# EAGLE schematic SchematProcesor (EAGLE 9.7.0)

## Sheet 1 of 3
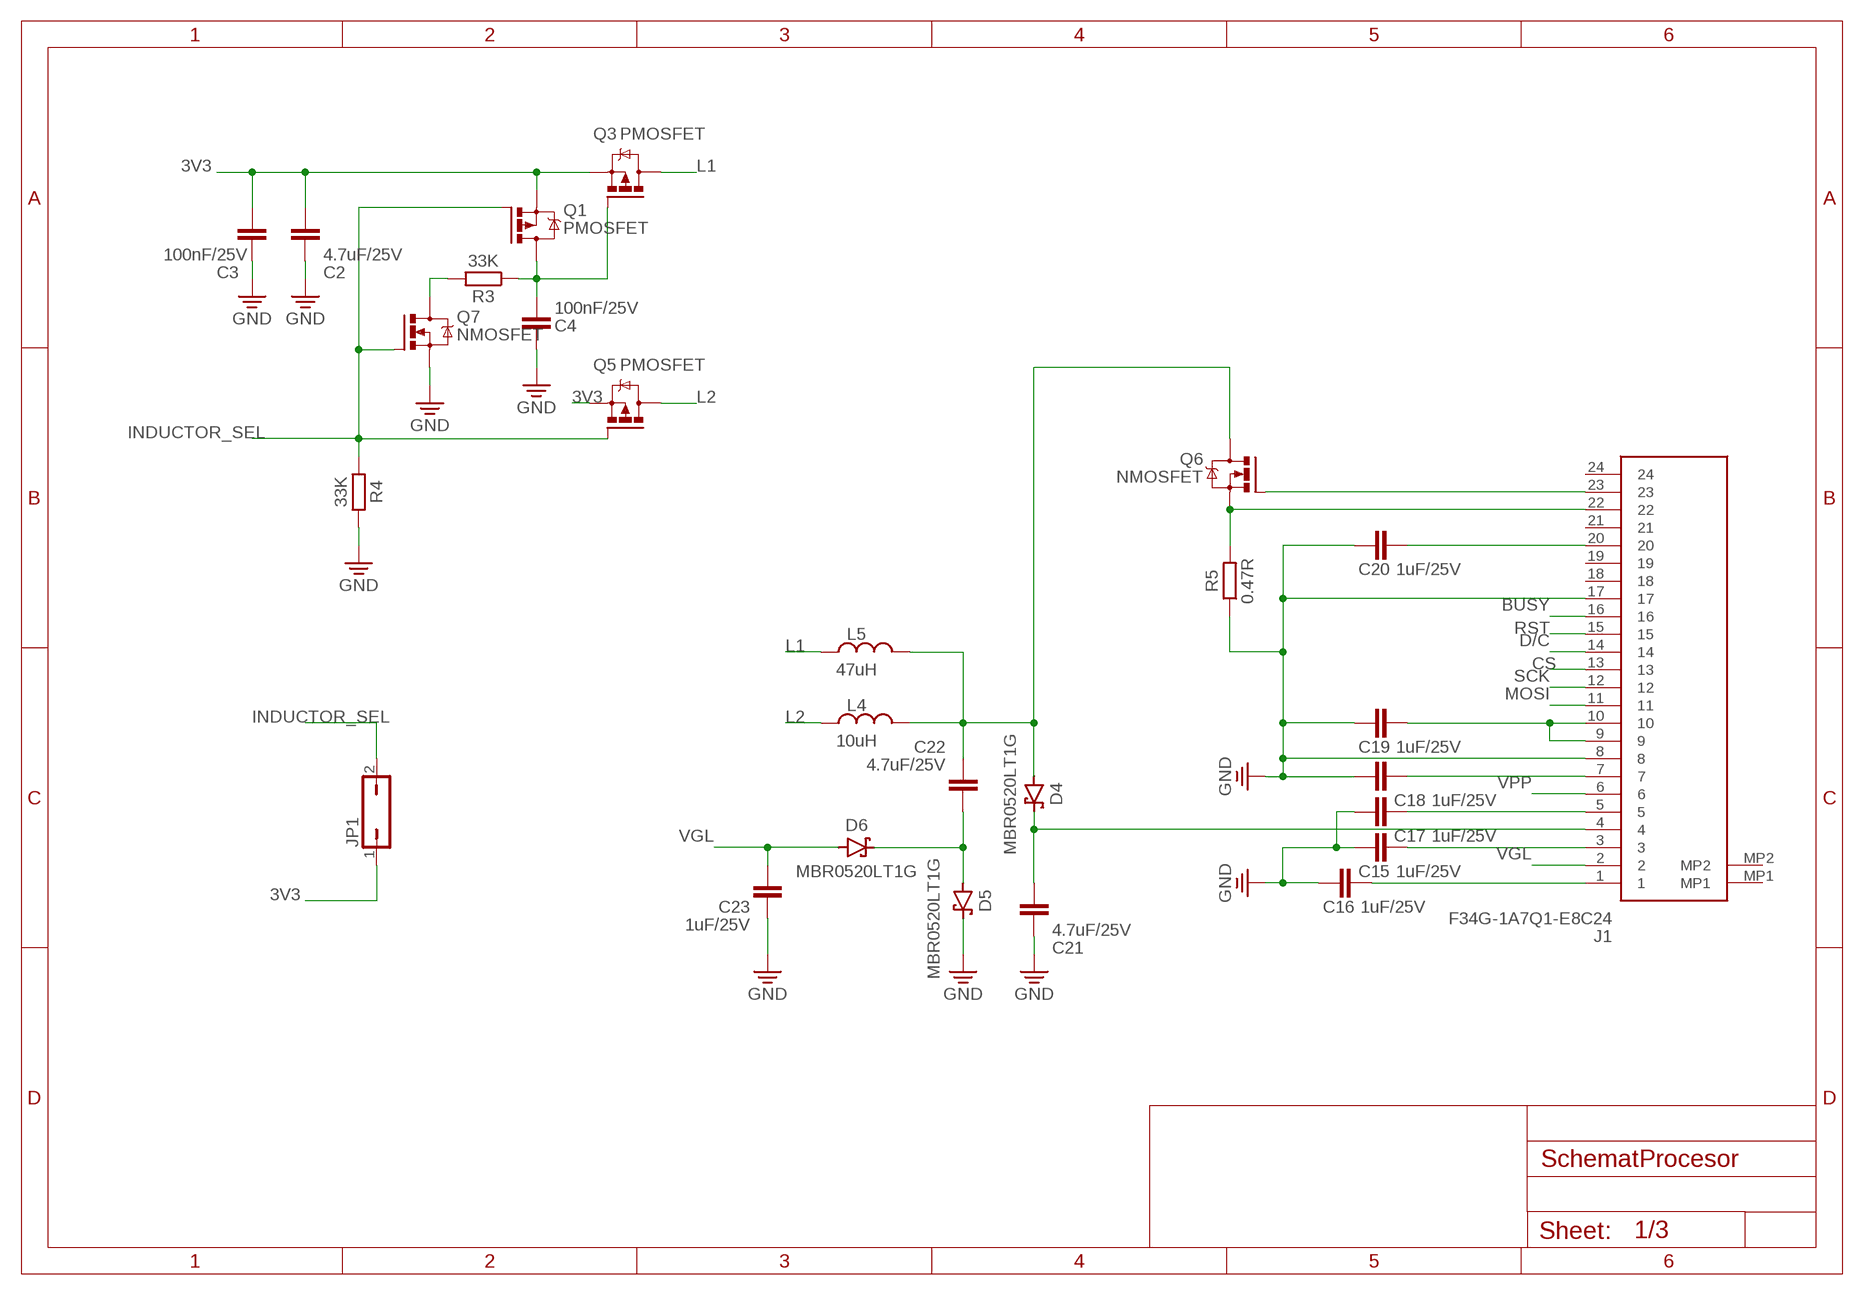
[diagram p0: schematic, sheet 1]

### Parts
C2  4.7uF/25V  C_CHIP-0603(1608-METRIC)  [CAPC1608X85]
C3  100nF/25V  C_CHIP-0603(1608-METRIC)  [CAPC1608X85]
C4  100nF/25V  C_CHIP-0603(1608-METRIC)  [CAPC1608X85]
C15  1uF/25V  C_CHIP-0603(1608-METRIC)  [CAPC1608X85]
C16  1uF/25V  C_CHIP-0603(1608-METRIC)  [CAPC1608X85]
C17  1uF/25V  C_CHIP-0603(1608-METRIC)  [CAPC1608X85]
C18  1uF/25V  C_CHIP-0603(1608-METRIC)  [CAPC1608X85]
C19  1uF/25V  C_CHIP-0603(1608-METRIC)  [CAPC1608X85]
C20  1uF/25V  C_CHIP-0603(1608-METRIC)  [CAPC1608X85]
C21  4.7uF/25V  C_CHIP-0603(1608-METRIC)  [CAPC1608X85]
C22  4.7uF/25V  C_CHIP-0603(1608-METRIC)  [CAPC1608X85]
C23  1uF/25V  C_CHIP-0603(1608-METRIC)  [CAPC1608X85]
D4  MBR0520LT1G  SCHOTTKY_MBR0520LT1GDO-219  [SODFL3718X115]
D5  MBR0520LT1G  SCHOTTKY_MBR0520LT1GDO-219  [SODFL3718X115]
D6  MBR0520LT1G  SCHOTTKY_MBR0520LT1GDO-219  [SODFL3718X115]
J1  F34G-1A7Q1-E8C24  [F34G1A7Q1E8C24]
JP1  JP1Q  [JP1]
L4  10uH  L_CHIP-0603(1608-METRIC)  [INDC1608X95N]
L5  47uH  L_CHIP-0603(1608-METRIC)  [INDC1608X95N]
Q1  PMOSFET  PMOSFET_SOT23-GSD  [SOT23]
Q3  PMOSFET  PMOSFET_SOT23-GSD  [SOT23]
Q5  PMOSFET  PMOSFET_SOT23-GSD  [SOT23]
Q6  NMOSFET  NMOSFETSOT23-GSD  [SOT23]
Q7  NMOSFET  NMOSFETSOT23-GSD  [SOT23]
R3  33K  R_CHIP-0603(1608-METRIC)  [RESC1608X60]
R4  33K  R_CHIP-0603(1608-METRIC)  [RESC1608X60]
R5  0.47R  R_CHIP-0603(1608-METRIC)  [RESC1608X60]

### Nets
3V3: C2.2 C3.2 JP1.1 Q1.2(S) Q3.2(S) Q5.2(S) ; also sheet 2,3
BUSY: J1.16 ; also sheet 3
CS: J1.13 ; also sheet 3
D/C: J1.14 ; also sheet 3
GND: C2.1 C3.1 C4.1 C15.1 C16.1 C17.1 C18.1 C19.1 C20.1 C21.1 C23.2 D5.1(C) J1.8 J1.17 Q7.2(S) R4.2 R5.1 ; also sheet 2,3
INDUCTOR_SEL: JP1.2 Q1.1(G) Q5.1(G) Q7.1(G) R4.1
L1: L5.1 Q3.3(D)
L2: L4.1 Q5.3(D)
MOSI: J1.11 ; also sheet 3
N$4: C4.2 Q1.3(D) Q3.1(G) R3.1
N$5: C16.2 J1.1
N$6: C15.2 J1.3
N$7: C17.2 J1.5
N$8: C18.2 J1.7
N$10: C19.2 J1.9 J1.10
N$11: Q7.3(D) R3.2
N$12: C20.2 J1.20
N$13: J1.23 Q6.1(G)
N$14: J1.22 Q6.2(S) R5.2
N$15: C21.2 D4.1(C) J1.4
N$16: C22.1 D4.2(A) L4.2 L5.2 Q6.3(D)
N$17: C22.2 D5.2(A) D6.1(C)
RST: J1.15 ; also sheet 3
SCK: J1.12 ; also sheet 3
VGL: C23.1 D6.2(A) J1.2
VPP: J1.6
Unconnected: J1.18 J1.19 J1.21 J1.24 J1.MP1 J1.MP2

## Sheet 2 of 3
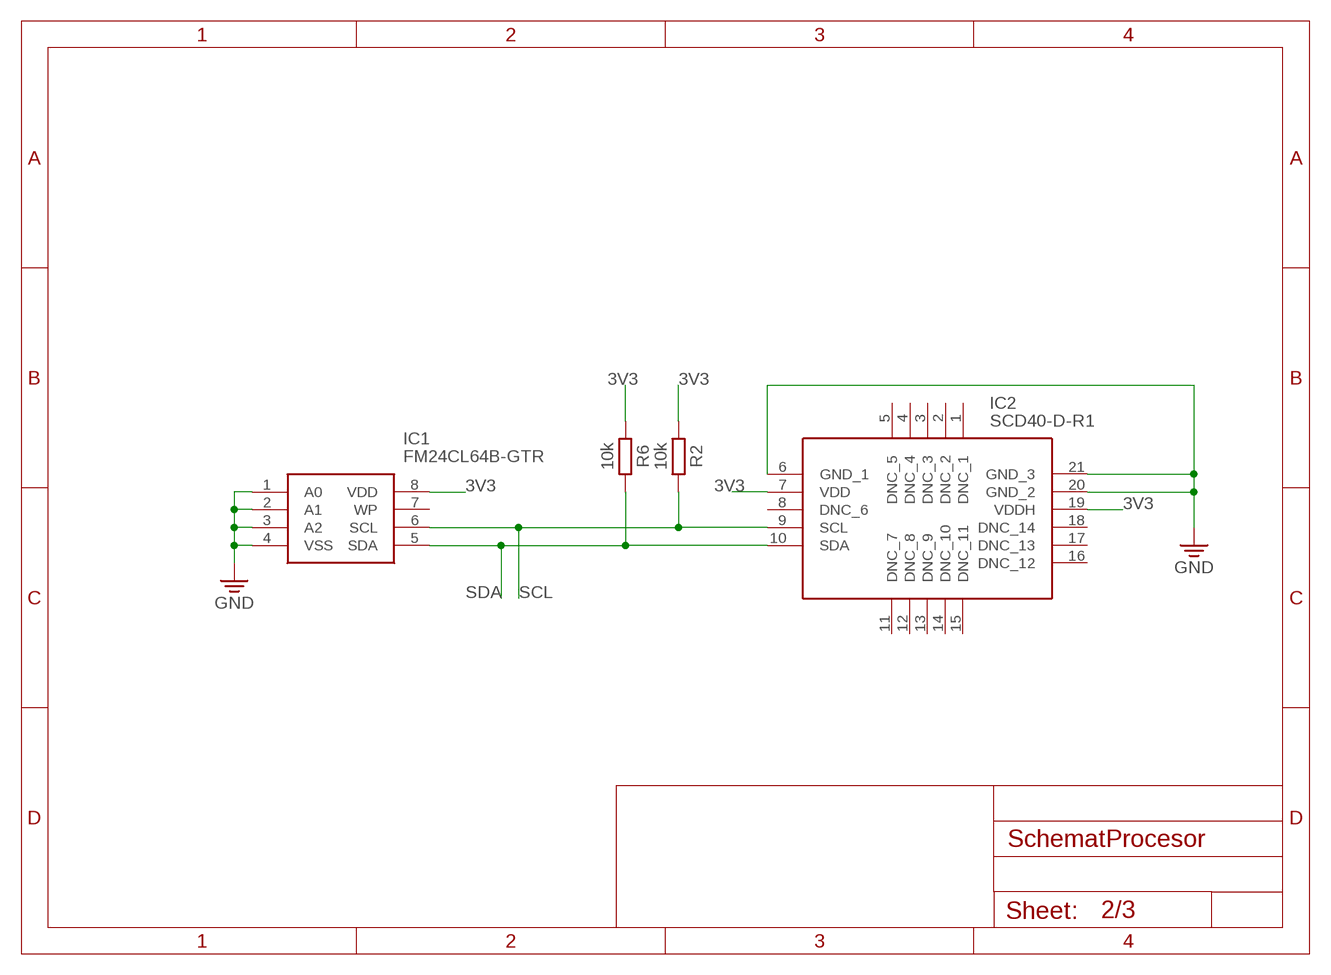
[diagram p1: schematic, sheet 2]

### Parts
IC1  FM24CL64B-GTR  [SOIC127P602X173-8N]
IC2  SCD40-D-R1  [SCD40DR1]
R2  10k  R_CHIP-0603(1608-METRIC)  [RESC1608X60]
R6  10k  R_CHIP-0603(1608-METRIC)  [RESC1608X60]

### Nets
3V3: IC1.8(VDD) IC2.7(VDD) IC2.19(VDDH) R2.1 R6.1 ; also sheet 1,3
GND: IC1.1(A0) IC1.2(A1) IC1.3(A2) IC1.4(VSS) IC2.6(GND_1) IC2.20(GND_2) IC2.21(GND_3) ; also sheet 1,3
SCL: IC1.6(SCL) IC2.9(SCL) R2.2 ; also sheet 3
SDA: IC1.5(SDA) IC2.10(SDA) R6.2 ; also sheet 3
Unconnected: IC1.7(WP) IC2.1(DNC_1) IC2.2(DNC_2) IC2.3(DNC_3) IC2.4(DNC_4) IC2.5(DNC_5) IC2.8(DNC_6) IC2.11(DNC_7) IC2.12(DNC_8) IC2.13(DNC_9) IC2.14(DNC_10) IC2.15(DNC_11) IC2.16(DNC_12) IC2.17(DNC_13) IC2.18(DNC_14)

## Sheet 3 of 3
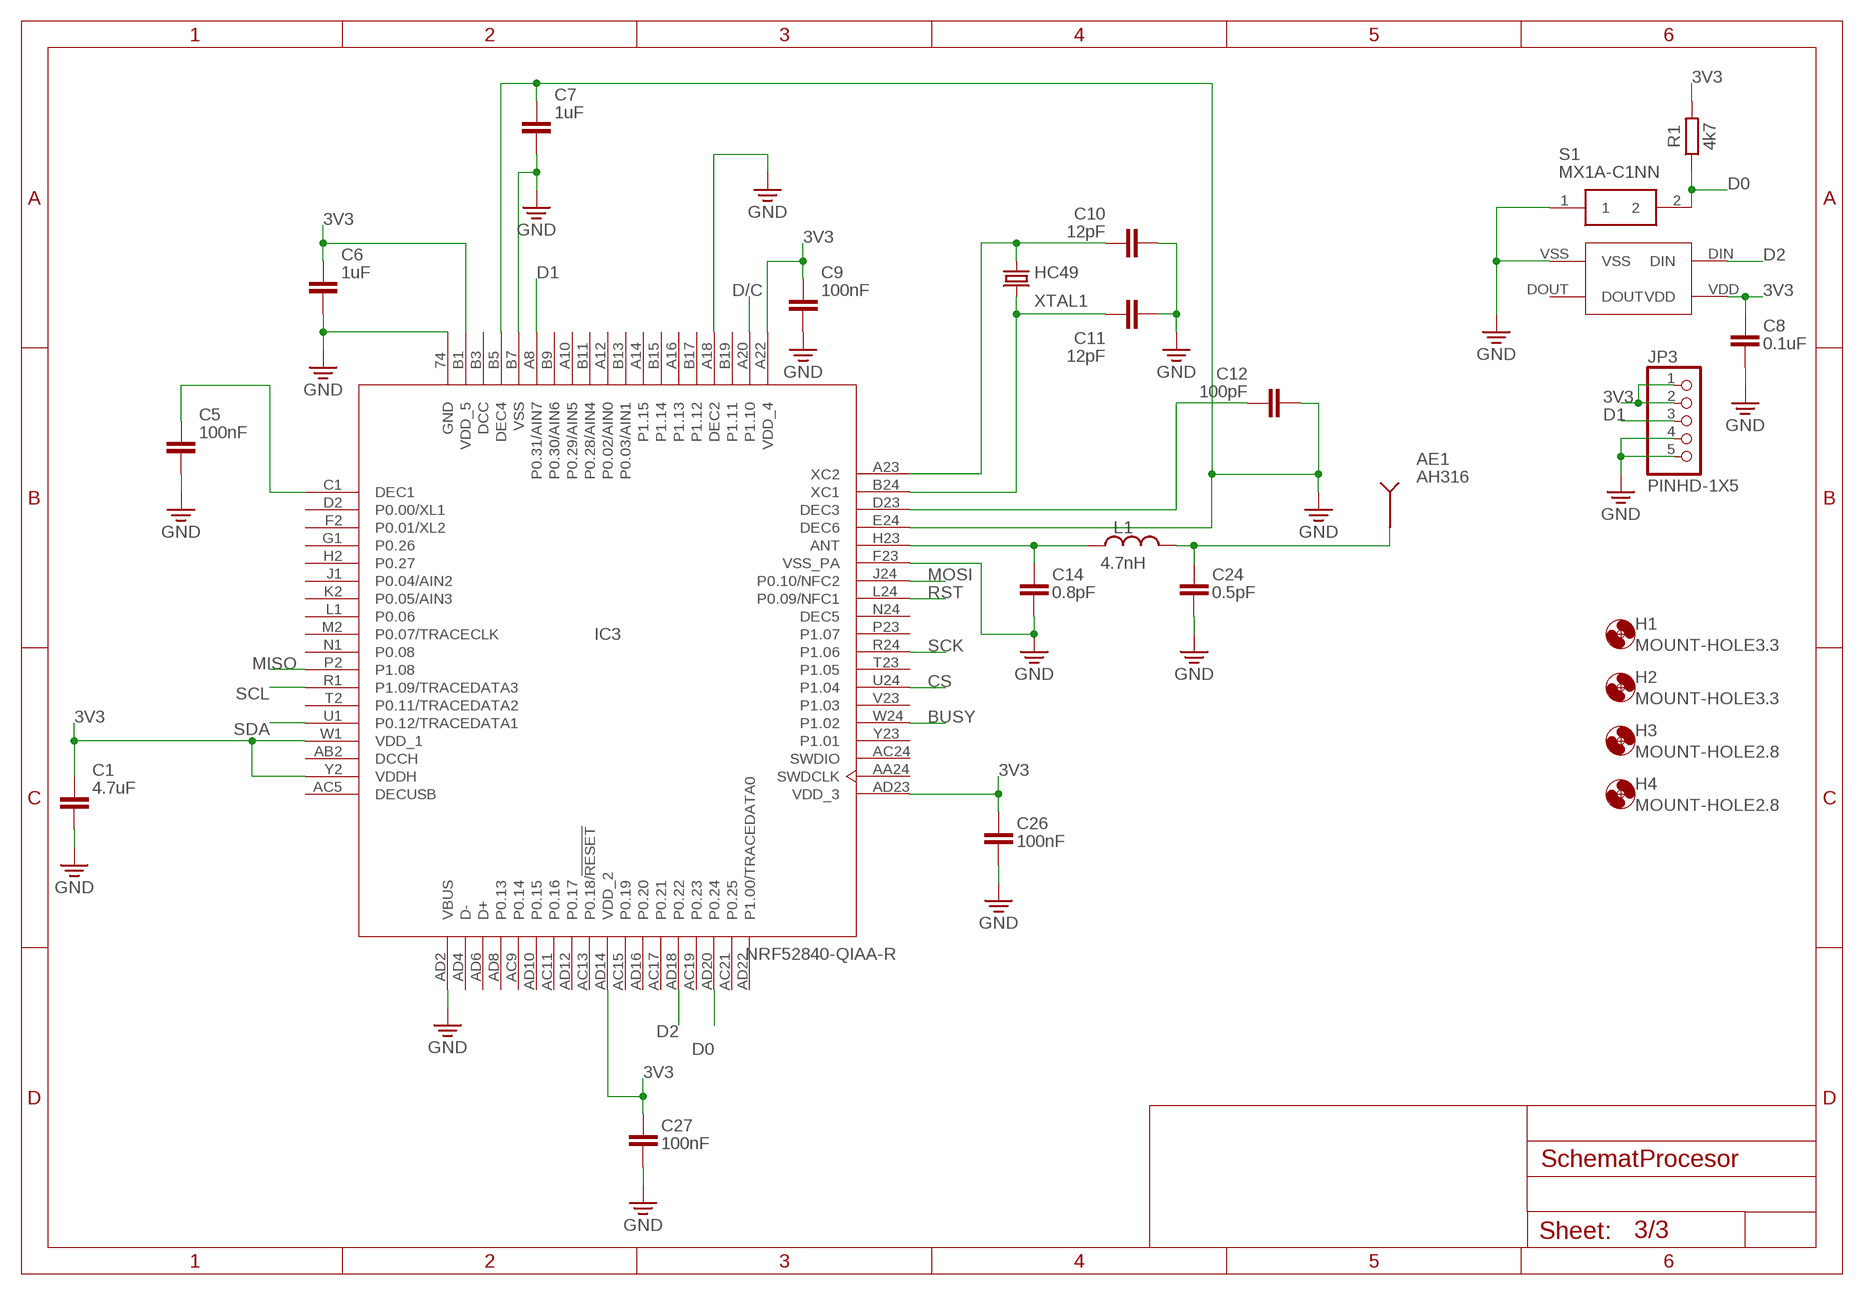
[diagram p2: schematic, sheet 3]

### Parts
AE1  AH316  [ANT-GPS-3.2X1MM]
C1  4.7uF  C_CHIP-0603(1608-METRIC)  [CAPC1608X85]
C5  100nF  C_CHIP-0603(1608-METRIC)  [CAPC1608X85]
C6  1uF  C_CHIP-0603(1608-METRIC)  [CAPC1608X85]
C7  1uF  C_CHIP-0603(1608-METRIC)  [CAPC1608X85]
C8  0.1uF  C_CHIP-0603(1608-METRIC)  [CAPC1608X85]
C9  100nF  C_CHIP-0603(1608-METRIC)  [CAPC1608X85]
C10  12pF  C_CHIP-0603(1608-METRIC)  [CAPC1608X85]
C11  12pF  C_CHIP-0603(1608-METRIC)  [CAPC1608X85]
C12  100pF  C_CHIP-0603(1608-METRIC)  [CAPC1608X85]
C14  0.8pF  C_CHIP-0603(1608-METRIC)  [CAPC1608X85]
C24  0.5pF  C_CHIP-0603(1608-METRIC)  [CAPC1608X85]
C26  100nF  C_CHIP-0603(1608-METRIC)  [CAPC1608X85]
C27  100nF  C_CHIP-0603(1608-METRIC)  [CAPC1608X85]
H1  MOUNT-HOLE3.3  [3,3]
H2  MOUNT-HOLE3.3  [3,3]
H3  MOUNT-HOLE2.8  [2,8]
H4  MOUNT-HOLE2.8  [2,8]
IC3  NRF52840-QIAA-R  [NRF52840-QIAA]
JP3  PINHD-1X5  [1X05]
L1  4.7nH  L_CHIP-0603(1608-METRIC)  [INDC1608X95N]
R1  4k7  R_CHIP-0402(1005-METRIC)  [RESC1005X40]
S1  MX1A-C1NN  [MX1AC1NN]
U$1  N0M59S10IC  [N0M59S10IC]
XTAL1  HC49  CRYSTAL_HC49-11.5L  [XTALRR488W45L1150T500H350B]

### Nets
3V3: C1.1 C6.1 C8.1 C9.1 C26.1 C27.1 IC3.A22(VDD_4) IC3.AD14(VDD_2) IC3.AD23(VDD_3) IC3.B1(VDD_5) IC3.W1(VDD_1) IC3.Y2(VDDH) JP3.1 JP3.2 R1.2 U$1.VDD ; also sheet 1,2
BUSY: IC3.W24(P1.02) ; also sheet 1
CS: IC3.U24(P1.04) ; also sheet 1
D0: IC3.AD20(P0.24) R1.1 S1.2
D1: IC3.A8(P0.31/AIN7) JP3.3
D2: IC3.AD18(P0.22) U$1.DIN
D/C: IC3.A20(P1.10) ; also sheet 1
GND: C1.2 C5.2 C6.2 C7.1 C7.2 C8.2 C9.2 C10.2 C11.2 C12.2 C14.2 C24.2 C26.2 C27.2 IC3.74(GND) IC3.A18(DEC2) IC3.AD2(VBUS) IC3.B5(DEC4) IC3.B7(VSS) IC3.E24(DEC6) IC3.F23(VSS_PA) JP3.4 JP3.5 S1.1 U$1.VSS ; also sheet 1,2
MISO: IC3.P2(P1.08)
MOSI: IC3.J24(P0.10/NFC2) ; also sheet 1
N$3: C11.1 IC3.B24(XC1) XTAL1.2
N$9: C10.1 IC3.A23(XC2) XTAL1.1
N$18: C14.1 IC3.H23(ANT) L1.1
N$19: C12.1 IC3.D23(DEC3)
N$20: AE1.2(GND) C24.1 L1.2
N$22: C5.1 IC3.C1(DEC1)
RST: IC3.L24(P0.09/NFC1) ; also sheet 1
SCK: IC3.R24(P1.06) ; also sheet 1
SCL: IC3.R1(P1.09/TRACEDATA3) ; also sheet 2
SDA: IC3.U1(P0.12/TRACEDATA1) ; also sheet 2
Unconnected: AE1.1(SIG) IC3.A10(P0.29/AIN5) IC3.A12(P0.02/AIN0) IC3.A14(P1.15) IC3.A16(P1.13) IC3.AA24(SWDCLK) IC3.AC9(P0.14) IC3.AC11(P0.16) IC3.AC13(P0.18/!RESET) IC3.AC15(P0.19) IC3.AC17(P0.21) IC3.AC19(P0.23) IC3.AC21(P0.25) IC3.AC24(SWDIO) IC3.AD4(D-) IC3.AD6(D+) IC3.AD8(P0.13) IC3.AD10(P0.15) IC3.AD12(P0.17) IC3.AD16(P0.20) IC3.AD22(P1.00/TRACEDATA0) IC3.B9(P0.30/AIN6) IC3.B11(P0.28/AIN4) IC3.B13(P0.03/AIN1) IC3.B15(P1.14) IC3.B17(P1.12) IC3.B19(P1.11) IC3.D2(P0.00/XL1) IC3.F2(P0.01/XL2) IC3.G1(P0.26) IC3.H2(P0.27) IC3.J1(P0.04/AIN2) IC3.K2(P0.05/AIN3) IC3.L1(P0.06) IC3.M2(P0.07/TRACECLK) IC3.N1(P0.08) IC3.P23(P1.07) IC3.T2(P0.11/TRACEDATA2) IC3.T23(P1.05) IC3.V23(P1.03) IC3.Y23(P1.01) U$1.DOUT

## Power pins joined to a net without a drawn wire
DCC: IC3.B3(DCC)
DCCH: IC3.AB2(DCCH)
DEC5: IC3.N24(DEC5)
DECUSB: IC3.AC5(DECUSB)

## Library data of the parts
AE1 = RF_Wireless:AH: 2.4GHz Chip RF Antenna 2.4GHz - 2.5GHz Datasheet <https://www.yuden.co.jp/productdata/catalog/chipantenna01_e.pdf>; CATEGORY: Antenna; DESCRIPTION: Antenna SURF MOUNT ANTENNA RADIEDGE; MANUFACTURER: Taiyo Yuden; MPN: AH316M245001-T; OPERATING_TEMPERATURE: - 40 C to +85 C; ROHS_COMPLIANT: COMPLIANT; SERIES: AH; SUB_CATEGORY: Antenna; TYPE: 2.4GHz Antenna - 2.4GHz, 5GHz, Bluetooth, WiFi, WLAN, Zigbee
C1-C12 C14-C24 C26 C27 = Capacitor:C: Capacitor - Generic; CATEGORY: Capacitor
D4-D6 = Diode:SCHOTTKY_: Schottky Diode - Popular parts; CATEGORY: Diode; DESCRIPTION: DIODE SCHOTTKY 20V 500MA SOD123; MANUFACTURER: ON Semiconductor; MPN: MBR0520LT1G; SUB-CATEGORY: Schottky
H1-H4 = holes:MOUNT-HOLE: MOUNTING HOLE with drill center marker
IC1 = SamacSys_Parts:FM24CL64B-GTR: CYPRESS - INFINEON TECHNOLOGIES - FM24CL64B-GTR - Ferroelectric RAM (FRAM), 64 Kbit (8K x 8) I2C, 1 MHz, 2.7 V to 3.65 V Supply, SOIC-8 Source: Datasheet <https://componentsearchengine.com/Datasheets/2/FM24CL64B-GTR.pdf>; DESCRIPTION: CYPRESS - INFINEON TECHNOLOGIES - FM24CL64B-GTR - Ferroelectric RAM (FRAM), 64 Kbit (8K x 8) I2C, 1 MHz, 2.7 V to 3.65 V Supply, SOIC-8; HEIGHT: 1.727mm; MANUFACTURER_NAME: Infineon; MANUFACTURER_PART_NUMBER: FM24CL64B-GTR; MOUSER_PART_NUMBER: 877-FM24CL64B-GTR; MOUSER_PRICE-STOCK: https://www.mouser.co.uk/ProductDetail/Infineon-Technologies/FM24CL64B-GTR?qs=pA5MXup5wxFBNKAQkjzmOA%3D%3D
IC2 = SamacSys_Parts:SCD40-D-R1: Breaking the size barrier in CO2 sensing Source: Datasheet <https://www.sensirion.com/fileadmin/user_upload/customers/sensirion/Dokumente/9.5_CO2/Sensirion_CO2_Sensors_SCD4x_Datasheet.pdf>; DESCRIPTION: Breaking the size barrier in CO2 sensing; HEIGHT: 6.8mm; MANUFACTURER_NAME: Sensirion; MANUFACTURER_PART_NUMBER: SCD40-D-R1; MOUSER_PART_NUMBER: 403-SCD40-D-R1; MOUSER_PRICE-STOCK: https://www.mouser.co.uk/ProductDetail/Sensirion/SCD40-D-R1?qs=HBWAp0VN4RjvSDpwiC%2F4pQ%3D%3D
IC3 = IC_Wireless-RF:NRF52840-QI: Bluetooth®5, IEEE 802.15.4-2006, 2.4 GHz transceiver - SoC Datasheet <https://infocenter.nordicsemi.com/pdf/nRF52840_PS_v1.1.pdf> Note : This Part needs to add a thermal vias on VSS_PAD while designing a board.; CATEGORY: IC_Wireless-RF; DESCRIPTION: Bluetooth ® 5, IEEE 802.15.4-2006, 2.4 GHz transceiver; FREQUENCY: 64MHz; IO: 48; MANUFACTURER: Nordic Semiconductor; MPN: nRF52840-QIAA-R; PART_STATUS: Active; ROHS_COMPLIANT: COMPLIANT; SERIES: nRF52840; SUB-CATEGORY: Bluetooth
J1 = Biblioteka:F34G-1A7Q1-E8C24: 24 Position FPC Connector Contacts, Bottom 0.020" (0.50mm) Surface Mount, Right Angle Source: Datasheet <https://cdn.amphenol-cs.com/media/wysiwyg/files/drawing/f34g.pdf>; DESCRIPTION: 24 Position FPC Connector Contacts, Bottom 0.020" (0.50mm) Surface Mount, Right Angle; HEIGHT: 1.75mm; MANUFACTURER_NAME: Amphenol; MANUFACTURER_PART_NUMBER: F34G-1A7Q1-E8C24; MOUSER_PART_NUMBER: 649-F34G1A7Q1E8C24; MOUSER_PRICE-STOCK: https://www.mouser.co.uk/ProductDetail/Amphenol-Aorora/F34G-1A7Q1-E8C24?qs=11PymoJGorK92cO6qHcfCw%3D%3D
JP1 = jumper:JP1Q: JUMPER
JP3 = Connector:PINHD-1X5: PIN HEADER; CATEGORY: Headers; DESCRIPTION: Header, Straight, 5 Position; MANUFACTURER: Generic; MPN: Generic; OPERATING_TEMPERATURE: Generic; PART_STATUS: Active; PITCH: 0.100" (2.54mm); ROHS_COMPLIANCE: Generic; SERIES: Generic; SUB-CATEGORY: Headers, Male Pins; TYPE: Board to Board or Cable, Unshrouded, Through Hole, Straight
L1 L4 L5 = Inductor:L: Inductor Fixed - Generic; CATEGORY: Inductor; SUB-CATEGORY: Fixed
Q1 Q3 Q5 = Transistor:PMOSFET: P-Channel MOSFET - Generic; CATEGORY: Transistor; SUB-CATEGORY: MOSFET; TYPE: P-Channel
Q6 Q7 = Transistor:NMOSFET: N-Channel MOSFET - Generic; CATEGORY: Transistor; SUB-CATEGORY: MOSFET; TYPE: N-Channel
R1-R6 = Resistor:R: Resistor Fixed - Generic; CATEGORY: Resistor; SUB-CATEGORY: Fixed
S1 = SamacSys_Parts:MX1A-C1NN: Pushbutton Switches Full Travel, Mech. Keyswitch Tactile Feel (Clear stem), 65cN No LED, No Diode Frame Mount (no fixation pins) Source: Datasheet <https://media.digikey.com/pdf/Data Sheets/Cherry PDFs/MX Series.pdf>; DESCRIPTION: Pushbutton Switches Full Travel, Mech. Keyswitch Tactile Feel (Clear stem), 65cN No LED, No Diode Frame Mount (no fixation pins); HEIGHT: 15.2mm; MANUFACTURER_NAME: Cherry; MANUFACTURER_PART_NUMBER: MX1A-C1NN; MOUSER_PART_NUMBER: 540-MX1A-C1NN; MOUSER_PRICE-STOCK: https://www.mouser.co.uk/ProductDetail/CHERRY/MX1A-C1NN?qs=Z9t1pRjfOcwvorA009Lo0w%3D%3D
U$1 = N0M59S10IC:N0M59S10IC
XTAL1 = Frequency-Source:CRYSTAL: Crystal 2Pin - Generic; CATEGORY: Frequency-Source; SUB-CATEGORY: Crystal-2Pin